# EAGLE board chess (EAGLE 6.1), part 1 of 2
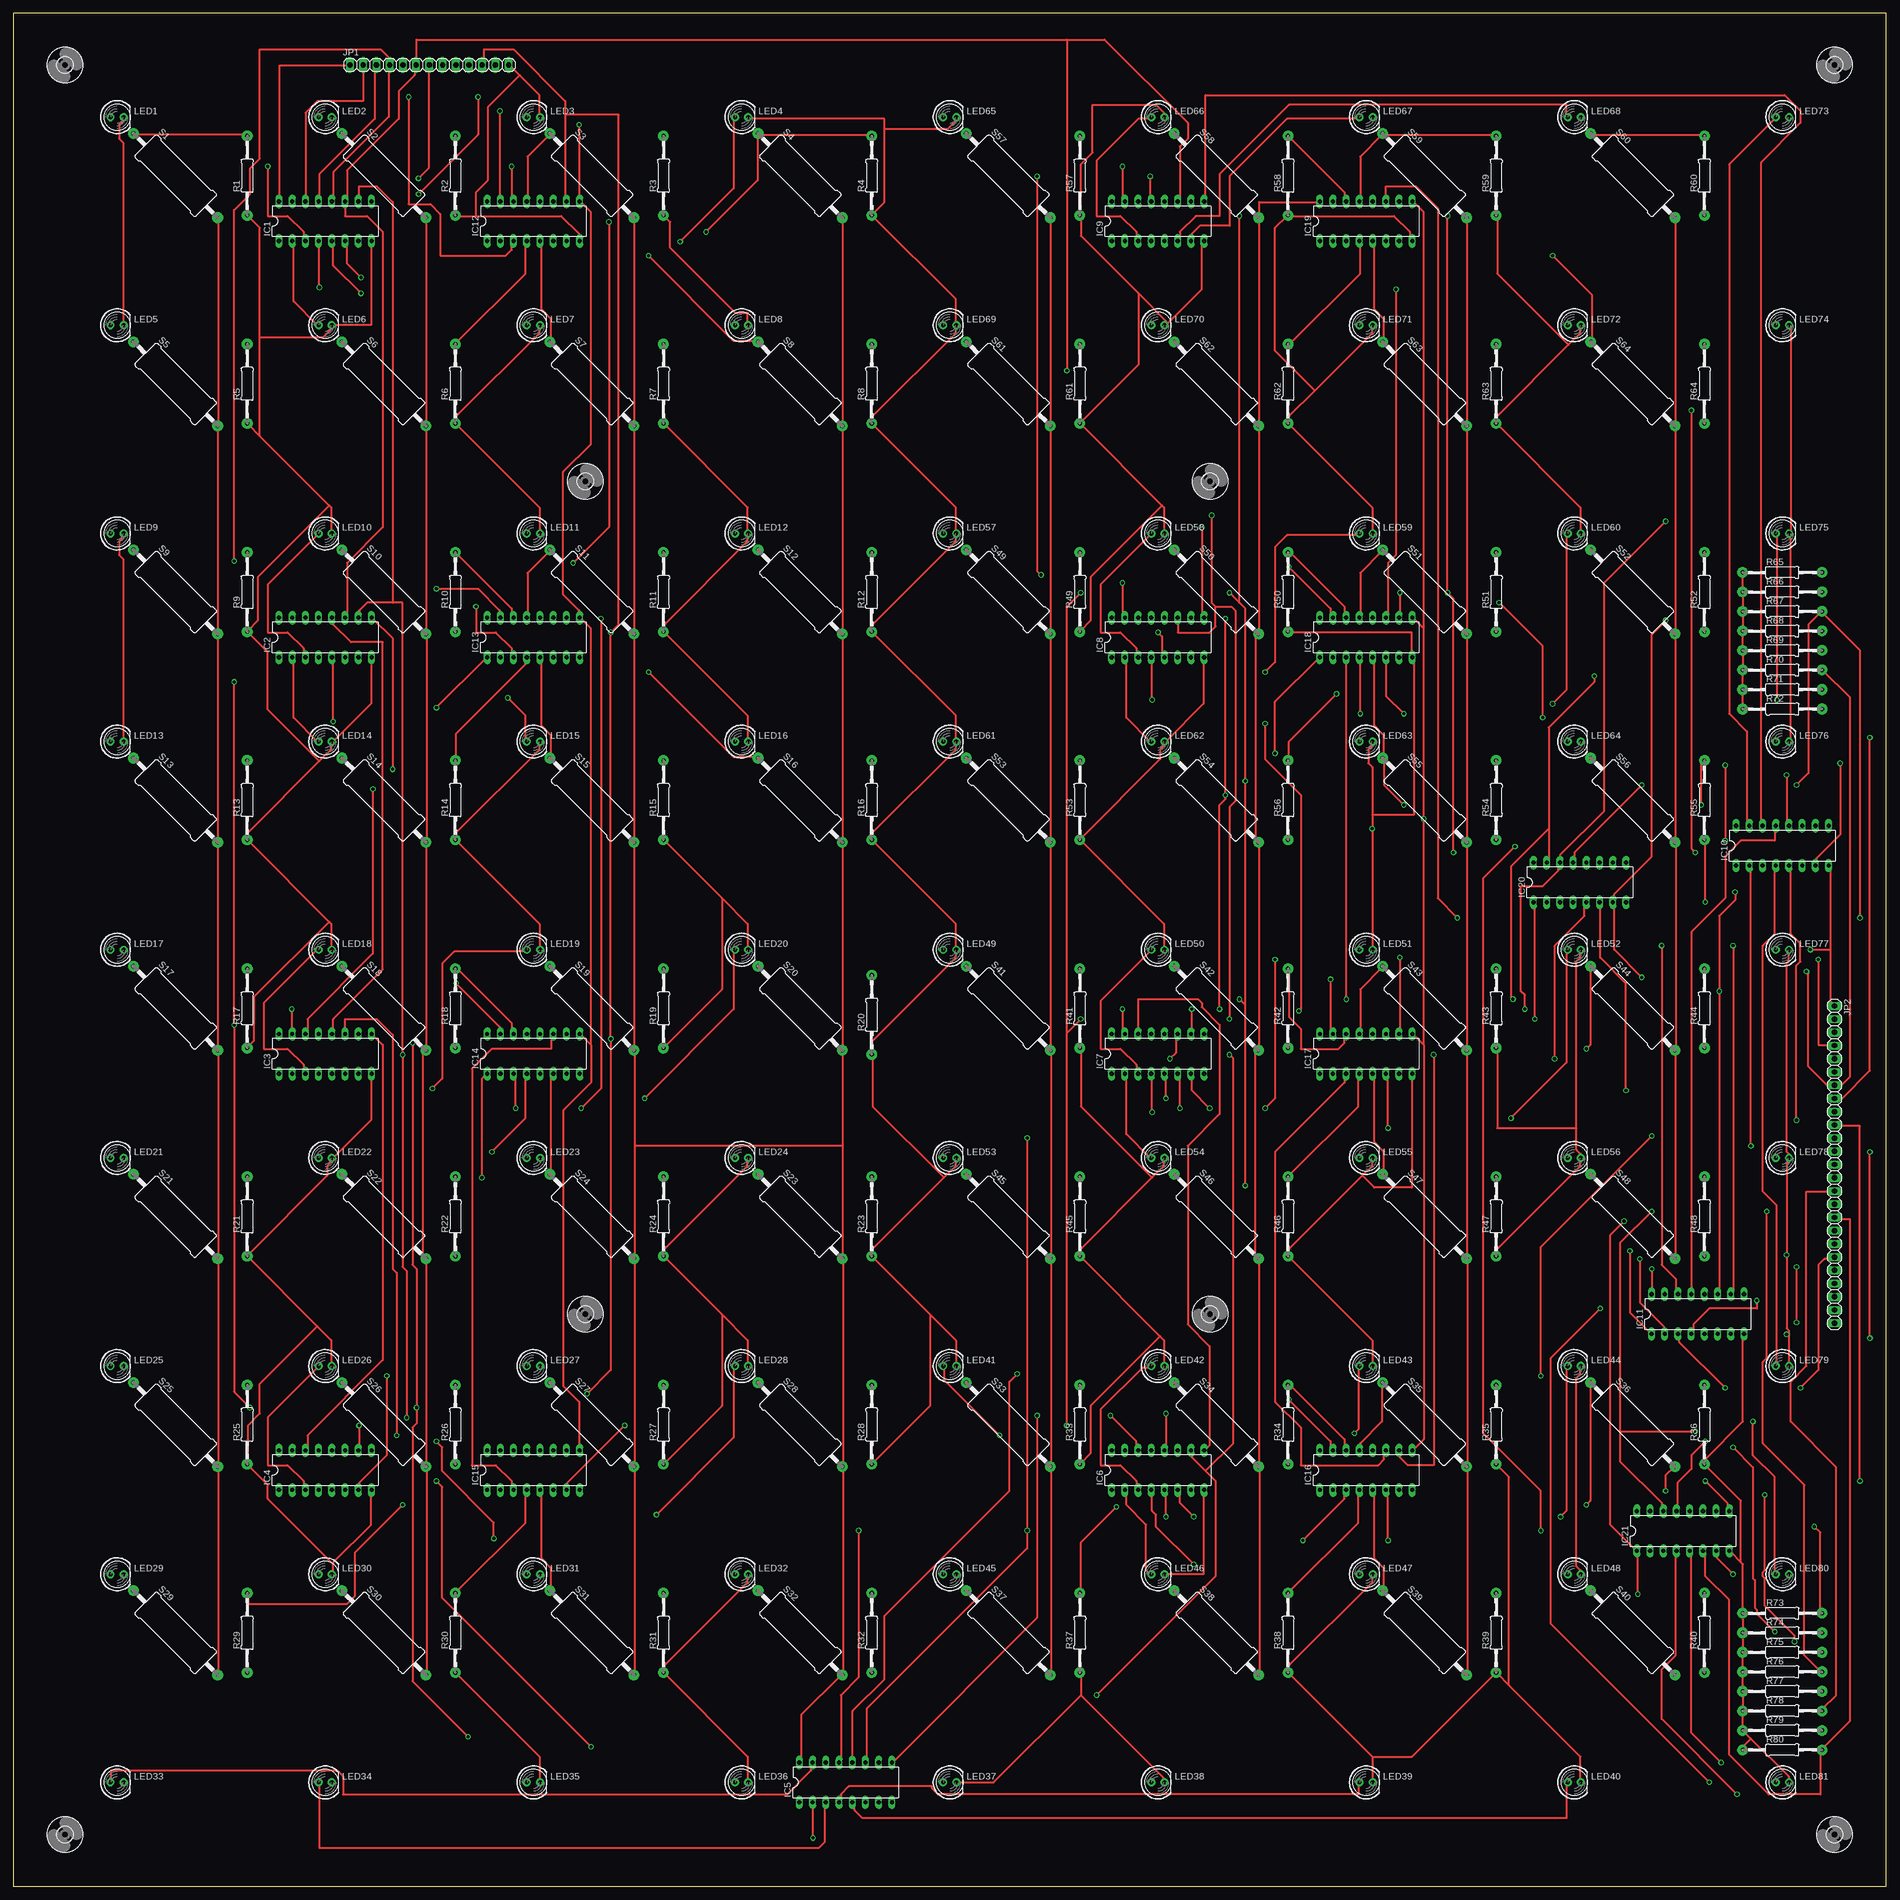
[diagram p5: board, top side]
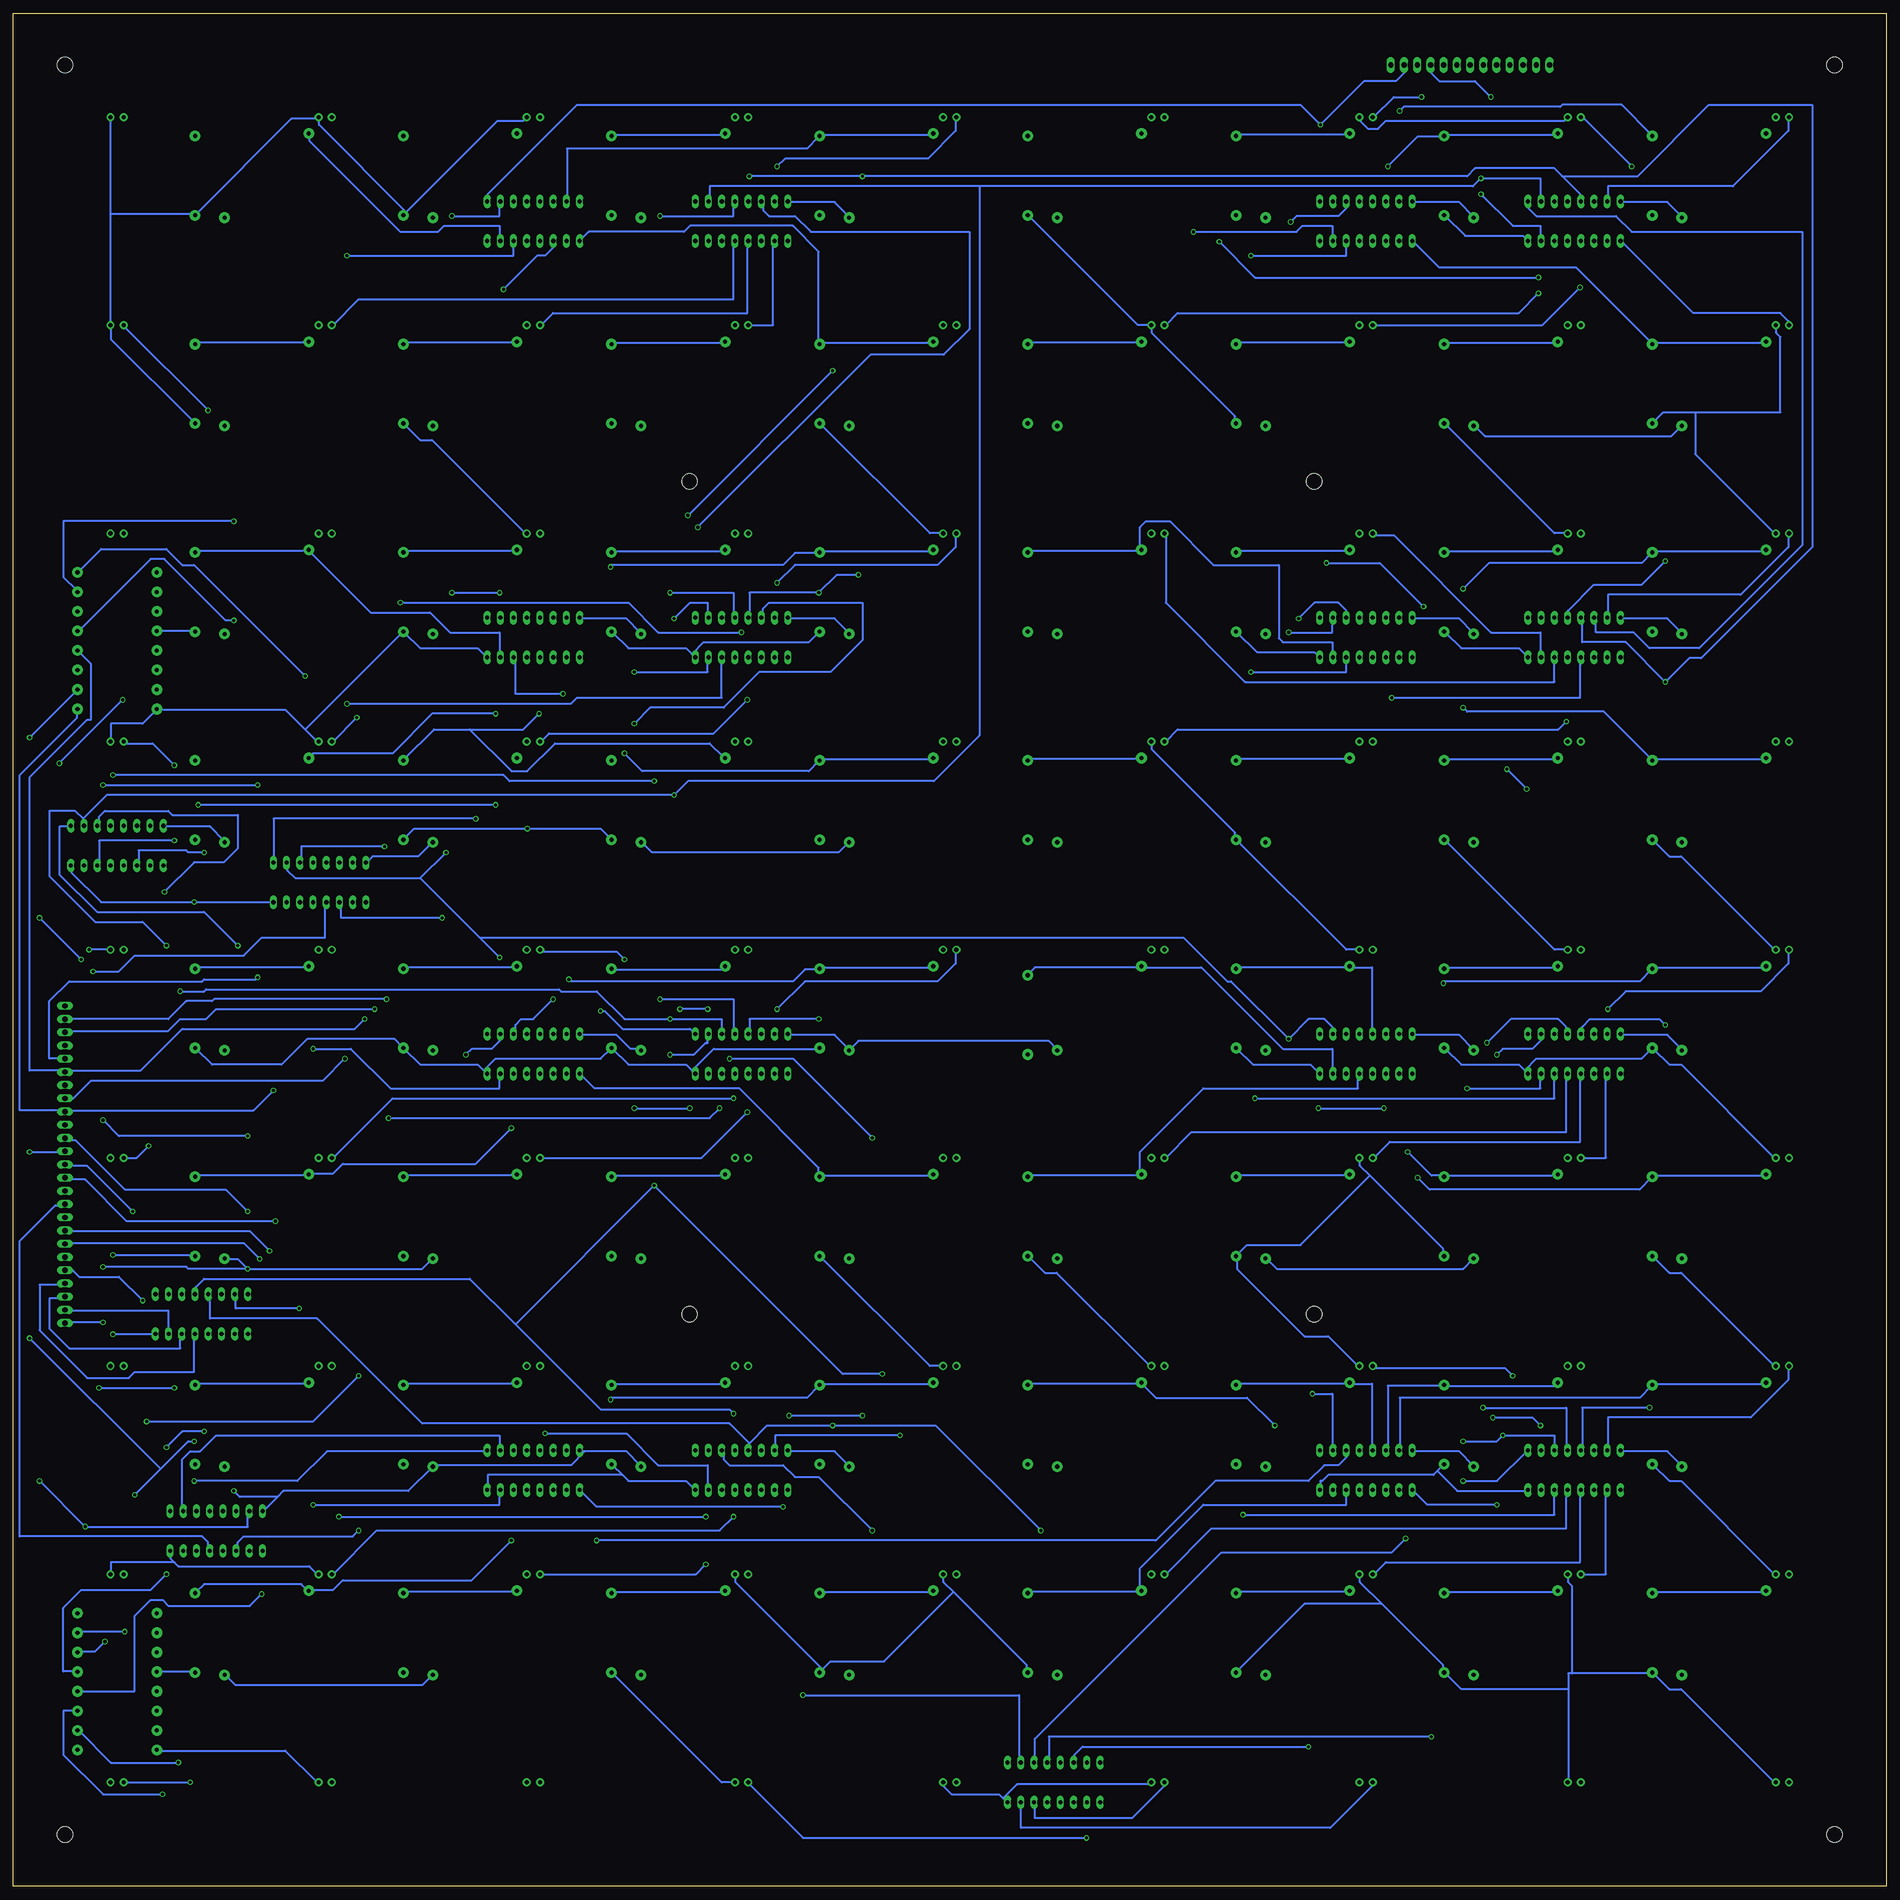
[diagram p6: board, bottom side, seen from below]

Size 360 x 360 mm. Coordinates in mm from the lower left corner, seen from the top.
Outline: 0,0 360,0 360,360 0,360 0,0
Copper layers (1*16): Top 0.035mm / dielectric 1.5mm / Bottom 0.035mm
Design rules: minimum track width 10mil, minimum drill 24mil, track to track 8mil, track to pad 8mil, pad to pad 8mil, via to via 8mil, smd to smd 8mil, copper to edge 40mil, drill to drill 8mil, minimum pad ring 10mil, minimum via ring 8mil, stop-mask expansion 4mil, vias tented up to drill 0mil, thermal gap 10mil
Net classes: 0 default: width 0.356 mm, clearance 1.219 mm

## Footprints (pad centres in the part's own frame; a part is rotated, then mirrored left to right if it is on the bottom)
3,0 = hole 3: 0,0
DIL16 = drill 0.813 long: 1 -8.89,-3.81; 2 -6.35,-3.81; 3 -3.81,-3.81; 4 -1.27,-3.81; 5 1.27,-3.81; 6 3.81,-3.81; 7 6.35,-3.81; 8 8.89,-3.81; 9 8.89,3.81; 10 6.35,3.81; 11 3.81,3.81; 12 1.27,3.81; 13 -1.27,3.81; 14 -3.81,3.81; 15 -6.35,3.81; 16 -8.89,3.81
1X13 = drill 1.016 long: 1 -15.24,0; 2 -12.7,0; 3 -10.16,0; 4 -7.62,0; 5 -5.08,0; 6 -2.54,0; 7 0,0; 8 2.54,0; 9 5.08,0; 10 7.62,0; 11 10.16,0; 12 12.7,0; 13 15.24,0
1X25 = drill 1.016 long: 1 -29.21,0; 2 -26.67,0; 3 -24.13,0; 4 -21.59,0; 5 -19.05,0; 6 -16.51,0; 7 -13.97,0; 8 -11.43,0; 9 -8.89,0; 10 -6.35,0; 11 -3.81,0; 12 -1.27,0; 13 1.27,0; 14 3.81,0; 15 6.35,0; 16 8.89,0; 17 11.43,0; 18 13.97,0; 19 16.51,0; 20 19.05,0; 21 21.59,0; 22 24.13,0; 23 26.67,0; 24 29.21,0; 25 31.75,0
LED5MM = drill 0.813 pad 1.524: A -1.27,0; K 1.27,0
0207/15 = drill 0.813 pad 2.032: 1 -7.62,0; 2 7.62,0
0617/22 = drill 0.813 pad 2.032: 1 -11.43,0; 2 11.43,0

## Placement (x,y rotation side)
H1  MOUNT-HOLE3.0  [3,0]  10,10 0 top
H2  MOUNT-HOLE3.0  [3,0]  10,350 0 top
H3  MOUNT-HOLE3.0  [3,0]  350,350 0 top
H4  MOUNT-HOLE3.0  [3,0]  350,10 0 top
H5  MOUNT-HOLE3.0  [3,0]  110,110 0 top
H6  MOUNT-HOLE3.0  [3,0]  230,110 0 top
H7  MOUNT-HOLE3.0  [3,0]  110,270 0 top
H8  MOUNT-HOLE3.0  [3,0]  230,270 0 top
IC1  74HC595N  [DIL16]  60,320 0 top
IC2  74HC595N  [DIL16]  60,240 0 top
IC3  74HC595N  [DIL16]  60,160 0 top
IC4  74HC595N  [DIL16]  60,80 0 top
IC5  74HC595N  [DIL16]  160,20 0 top
IC6  74HC595N  [DIL16]  220,80 0 top
IC7  74HC595N  [DIL16]  220,160 0 top
IC8  74HC595N  [DIL16]  220,240 0 top
IC9  74HC595N  [DIL16]  220,320 0 top
IC10  74HC595N  [DIL16]  340,200 0 top
IC11  74HC595N  [DIL16]  323.75,110 0 top
IC12  4021N  [DIL16]  100,320 0 top
IC13  4021N  [DIL16]  100,240 0 top
IC14  4021N  [DIL16]  100,160 0 top
IC15  4021N  [DIL16]  100,80 0 top
IC16  4021N  [DIL16]  260,80 0 top
IC17  4021N  [DIL16]  260,160 0 top
IC18  4021N  [DIL16]  260,240 0 top
IC19  4021N  [DIL16]  260,320 0 top
IC20  4021N  [DIL16]  301.07,192.93 0 top
IC21  4021N  [DIL16]  320.93,68.3 0 top
JP1  JP1  [1X13]  80,350 0 top
JP2  JP1  [1X25]  350,140 270 top
LED1  [LED5MM]  20,340 0 top
LED2  [LED5MM]  60,340 0 top
LED3  [LED5MM]  100,340 0 top
LED4  [LED5MM]  140,340 0 top
LED5  [LED5MM]  20,300 0 top
LED6  [LED5MM]  60,300 0 top
LED7  [LED5MM]  100,300 0 top
LED8  [LED5MM]  140,300 0 top
LED9  [LED5MM]  20,260 0 top
LED10  [LED5MM]  60,260 0 top
LED11  [LED5MM]  100,260 0 top
LED12  [LED5MM]  140,260 0 top
LED13  [LED5MM]  20,220 0 top
LED14  [LED5MM]  60,220 0 top
LED15  [LED5MM]  100,220 0 top
LED16  [LED5MM]  140,220 0 top
LED17  [LED5MM]  20,180 0 top
LED18  [LED5MM]  60,180 0 top
LED19  [LED5MM]  100,180 0 top
LED20  [LED5MM]  140,180 0 top
LED21  [LED5MM]  20,140 0 top
LED22  [LED5MM]  60,140 0 top
LED23  [LED5MM]  100,140 0 top
LED24  [LED5MM]  140,140 0 top
LED25  [LED5MM]  20,100 0 top
LED26  [LED5MM]  60,100 0 top
LED27  [LED5MM]  100,100 0 top
LED28  [LED5MM]  140,100 0 top
LED29  [LED5MM]  20,60 0 top
LED30  [LED5MM]  60,60 0 top
LED31  [LED5MM]  100,60 0 top
LED32  [LED5MM]  140,60 0 top
LED33  [LED5MM]  20,20 0 top
LED34  [LED5MM]  60,20 0 top
LED35  [LED5MM]  100,20 0 top
LED36  [LED5MM]  140,20 0 top
LED37  [LED5MM]  180,20 0 top
LED38  [LED5MM]  220,20 0 top
LED39  [LED5MM]  260,20 0 top
LED40  [LED5MM]  300,20 0 top
LED41  [LED5MM]  180,100 0 top
LED42  [LED5MM]  220,100 0 top
LED43  [LED5MM]  260,100 0 top
LED44  [LED5MM]  300,100 0 top
LED45  [LED5MM]  180,60 0 top
LED46  [LED5MM]  220,60 0 top
LED47  [LED5MM]  260,60 0 top
LED48  [LED5MM]  300,60 0 top
LED49  [LED5MM]  180,180 0 top
LED50  [LED5MM]  220,180 0 top
LED51  [LED5MM]  260,180 0 top
LED52  [LED5MM]  300,180 0 top
LED53  [LED5MM]  180,140 0 top
LED54  [LED5MM]  220,140 0 top
LED55  [LED5MM]  260,140 0 top
LED56  [LED5MM]  300,140 0 top
LED57  [LED5MM]  180,260 0 top
LED58  [LED5MM]  220,260 0 top
LED59  [LED5MM]  260,260 0 top
LED60  [LED5MM]  300,260 0 top
LED61  [LED5MM]  180,220 0 top
LED62  [LED5MM]  220,220 0 top
LED63  [LED5MM]  260,220 0 top
LED64  [LED5MM]  300,220 0 top
LED65  [LED5MM]  180,340 0 top
LED66  [LED5MM]  220,340 0 top
LED67  [LED5MM]  260,340 0 top
LED68  [LED5MM]  300,340 0 top
LED69  [LED5MM]  180,300 0 top
LED70  [LED5MM]  220,300 0 top
LED71  [LED5MM]  260,300 0 top
LED72  [LED5MM]  300,300 0 top
LED73  [LED5MM]  340,340 0 top
LED74  [LED5MM]  340,300 0 top
LED75  [LED5MM]  340,260 0 top
LED76  [LED5MM]  340,220 0 top
LED77  [LED5MM]  340,180 0 top
LED78  [LED5MM]  340,140 0 top
LED79  [LED5MM]  340,100 0 top
LED80  [LED5MM]  340,60 0 top
LED81  [LED5MM]  340,20 0 top
R1  [0207/15]  45,328.75 90 top
R2  [0207/15]  85,328.75 90 top
R3  [0207/15]  125,328.75 90 top
R4  [0207/15]  165,328.75 90 top
R5  [0207/15]  45,288.75 90 top
R6  [0207/15]  85,288.75 90 top
R7  [0207/15]  125,288.75 90 top
R8  [0207/15]  165,288.75 90 top
R9  [0207/15]  45,248.75 90 top
R10  [0207/15]  85,248.75 90 top
R11  [0207/15]  125,248.75 90 top
R12  [0207/15]  165,248.75 90 top
R13  [0207/15]  45,208.75 90 top
R14  [0207/15]  85,208.75 90 top
R15  [0207/15]  125,208.75 90 top
R16  [0207/15]  165,208.75 90 top
R17  [0207/15]  45,168.75 90 top
R18  [0207/15]  85,168.75 90 top
R19  [0207/15]  125,168.75 90 top
R20  [0207/15]  165,167.5 90 top
R21  [0207/15]  45,128.75 90 top
R22  [0207/15]  85,128.75 90 top
R23  [0207/15]  165,128.75 90 top
R24  [0207/15]  125,128.75 90 top
R25  [0207/15]  45,88.75 90 top
R26  [0207/15]  85,88.75 90 top
R27  [0207/15]  125,88.75 90 top
R28  [0207/15]  165,88.75 90 top
R29  [0207/15]  45,48.75 90 top
R30  [0207/15]  85,48.75 90 top
R31  [0207/15]  125,48.75 90 top
R32  [0207/15]  165,48.75 90 top
R33  [0207/15]  205,88.75 90 top
R34  [0207/15]  245,88.75 90 top
R35  [0207/15]  285,88.75 90 top
R36  [0207/15]  325,88.75 90 top
R37  [0207/15]  205,48.75 90 top
R38  [0207/15]  245,48.75 90 top
R39  [0207/15]  285,48.75 90 top
R40  [0207/15]  325,48.75 90 top
R41  [0207/15]  205,168.75 90 top
R42  [0207/15]  245,168.75 90 top
R43  [0207/15]  285,168.75 90 top
R44  [0207/15]  325,168.75 90 top
R45  [0207/15]  205,128.75 90 top
R46  [0207/15]  245,128.75 90 top
R47  [0207/15]  285,128.75 90 top
R48  [0207/15]  325,128.75 90 top
R49  [0207/15]  205,248.75 90 top
R50  [0207/15]  245,248.75 90 top
R51  [0207/15]  285,248.75 90 top
R52  [0207/15]  325,248.75 90 top
R53  [0207/15]  205,208.75 90 top
R54  [0207/15]  285,208.75 90 top
R55  [0207/15]  325,208.75 90 top
R56  [0207/15]  245,208.75 90 top
R57  [0207/15]  205,328.75 90 top
R58  [0207/15]  245,328.75 90 top
R59  [0207/15]  285,328.75 90 top
R60  [0207/15]  325,328.75 90 top
R61  [0207/15]  205,288.75 90 top
R62  [0207/15]  245,288.75 90 top
R63  [0207/15]  285,288.75 90 top
R64  [0207/15]  325,288.75 90 top
R65  [0207/15]  340,252.5 0 top
R66  [0207/15]  340,248.75 0 top
R67  [0207/15]  340,245 0 top
R68  [0207/15]  340,241.25 0 top
R69  [0207/15]  340,237.5 0 top
R70  [0207/15]  340,233.75 0 top
R71  [0207/15]  340,230 0 top
R72  [0207/15]  340,226.25 0 top
R73  [0207/15]  340,52.5 0 top
R74  [0207/15]  340,48.75 0 top
R75  [0207/15]  340,45 0 top
R76  [0207/15]  340,41.25 0 top
R77  [0207/15]  340,37.5 0 top
R78  [0207/15]  340,33.75 0 top
R79  [0207/15]  340,30 0 top
R80  [0207/15]  340,26.25 0 top
S1  [0617/22]  31.25,328.75 315 top
S2  [0617/22]  71.25,328.75 315 top
S3  [0617/22]  111.25,328.75 315 top
S4  [0617/22]  151.25,328.75 315 top
S5  [0617/22]  31.25,288.75 315 top
S6  [0617/22]  71.25,288.75 315 top
S7  [0617/22]  111.25,288.75 315 top
S8  [0617/22]  151.25,288.75 315 top
S9  [0617/22]  31.25,248.75 315 top
S10  [0617/22]  71.25,248.75 315 top
S11  [0617/22]  111.25,248.75 315 top
S12  [0617/22]  151.25,248.75 315 top
S13  [0617/22]  31.25,208.75 315 top
S14  [0617/22]  71.25,208.75 315 top
S15  [0617/22]  111.25,208.75 315 top
S16  [0617/22]  151.25,208.75 315 top
S17  [0617/22]  31.25,168.75 315 top
S18  [0617/22]  71.25,168.75 315 top
S19  [0617/22]  111.25,168.75 315 top
S20  [0617/22]  151.25,168.75 315 top
S21  [0617/22]  31.25,128.75 315 top
S22  [0617/22]  71.25,128.75 315 top
S23  [0617/22]  151.25,128.75 315 top
S24  [0617/22]  111.25,128.75 315 top
S25  [0617/22]  31.25,88.75 315 top
S26  [0617/22]  71.25,88.75 315 top
S27  [0617/22]  111.25,88.75 315 top
S28  [0617/22]  151.25,88.75 315 top
S29  [0617/22]  31.25,48.75 315 top
S30  [0617/22]  71.25,48.75 315 top
S31  [0617/22]  111.25,48.75 315 top
S32  [0617/22]  151.25,48.75 315 top
S33  [0617/22]  191.25,88.75 315 top
S34  [0617/22]  231.25,88.75 315 top
S35  [0617/22]  271.25,88.75 315 top
S36  [0617/22]  311.25,88.75 315 top
S37  [0617/22]  191.25,48.75 315 top
S38  [0617/22]  231.25,48.75 315 top
S39  [0617/22]  271.25,48.75 315 top
S40  [0617/22]  311.25,48.75 315 top
S41  [0617/22]  191.25,168.75 315 top
S42  [0617/22]  231.25,168.75 315 top
S43  [0617/22]  271.25,168.75 315 top
S44  [0617/22]  311.25,168.75 315 top
S45  [0617/22]  191.25,128.75 315 top
S46  [0617/22]  231.25,128.75 315 top
S47  [0617/22]  271.25,128.75 315 top
S48  [0617/22]  311.25,128.75 315 top
S49  [0617/22]  191.25,248.75 315 top
S50  [0617/22]  231.25,248.75 315 top
S51  [0617/22]  271.25,248.75 315 top
S52  [0617/22]  311.25,248.75 315 top
S53  [0617/22]  191.25,208.75 315 top
S54  [0617/22]  231.25,208.75 315 top
S55  [0617/22]  271.25,208.75 315 top
S56  [0617/22]  311.25,208.75 315 top
S57  [0617/22]  191.25,328.75 315 top
S58  [0617/22]  231.25,328.75 315 top
S59  [0617/22]  271.25,328.75 315 top
S60  [0617/22]  311.25,328.75 315 top
S61  [0617/22]  191.25,288.75 315 top
S62  [0617/22]  231.25,288.75 315 top
S63  [0617/22]  271.25,288.75 315 top
S64  [0617/22]  311.25,288.75 315 top

## Tracks (layer width: path | path; a pad name or v marks a point on that pad's centre or on a via)
CLK  (via drill 0.61)
  Top 0.356: 106.11,340.43 106.11,343.09 96.2,353 90.49,353 90.49,350.33 JP1.11 | 106.11,340.43 106.11,324.04 IC12.10 | v110.3,94.68 114.87,99.25 v114.87,162.88 v114.87,240.99 116.4,242.51 116.4,340.43 106.11,340.43 | v266.51,178.5 266.51,164.02 IC17.10 | v266.51,248.61 266.51,244.03 IC18.10 | v276.8,198.69 276.8,247.46 v275.66,248.61 v275.66,321 | v272.99,159.83 272.99,80.97 268.04,80.97 266.51,82.49 266.51,83.63 IC16.10
  Bottom 0.356: v110.3,94.68 106.49,94.68 106.49,84.01 IC15.10 | IC14.10 106.49,164.02 106.49,165.17 108.02,166.69 111.06,166.69 v114.87,162.88 125.92,173.93 126.69,173.93 135.07,182.31 270.32,182.31 | v114.87,240.99 106.49,240.99 106.49,243.65 IC13.10 | IC16.10 266.51,84.01 266.51,86.68 321,86.68 324.04,83.63 325.95,83.63 327.47,82.11 327.47,72.2 IC21.10 | 281.75,193.74 270.32,182.31 | 270.32,182.31 v266.51,178.5 | 281.75,193.74 305.75,193.74 307.28,195.26 307.28,196.41 IC20.10 | v275.66,248.61 v266.51,248.61 | 281.75,193.74 v276.8,198.69 | v275.66,321 266.51,321 266.51,323.66 IC19.10 | v272.99,159.83 271.85,160.97 268.04,160.97 266.51,162.5 266.51,163.64 IC17.10
G  (via drill 0.61)
  Top 0.356: IC11.13 322.52,114.11 322.52,183.45 329,189.93 329,197.93 332.04,200.98 338.52,200.98 338.52,203.65 IC10.13 | v162.5,68.39 162.5,40.2 159.07,36.77 159.07,23.81 IC5.13 | 202.5,164.02 v205.17,166.69 | v202.5,88.58 202.5,164.02 | v205.17,248.61 202.5,245.94 202.5,164.02 | v45.53,92.01 42.48,95.06 v42.48,165.55 v42.48,231.46 | IC1.13 58.87,324.04 58.87,329 69.53,339.66 69.53,349.95 JP1.3 | v218.51,328.62 218.51,324.04 IC9.13 | v197.55,252.03 196.79,252.8 v196.79,328.62
  Bottom 0.356: v162.5,68.39 182.69,88.58 v202.5,88.58 215.08,88.58 218.51,85.16 | 218.51,85.16 218.51,84.01 IC6.13 | v205.17,166.69 218.51,166.69 218.51,164.02 IC7.13 | IC8.13 218.51,244.03 218.51,248.61 v205.17,248.61 201.74,252.03 v197.55,252.03 | 218.51,85.16 222.32,88.97 281.37,88.97 301.56,109.16 322.14,109.16 322.14,113.73 IC11.13 | v45.53,92.01 58.49,92.01 58.49,84.01 IC4.13 | v42.48,165.55 43.63,166.69 56.96,166.69 58.49,165.17 58.49,164.02 IC3.13 | IC2.13 58.49,243.65 58.49,239.08 50.1,239.08 v42.48,231.46 37.91,236.03 35.63,236.03 14.29,257.37 14.29,342.33 34.1,342.33 47.82,328.62 62.3,328.62 | v218.51,328.62 v196.79,328.62 80.58,328.62 79.06,330.14 63.82,330.14 62.3,328.62 | 62.3,328.62 58.87,325.19 58.87,324.04 IC1.13
GND  (via drill 0.61)
  Top 0.356: LED74.K 341.57,299.66 341.57,260.04 LED75.K 341.57,259.65 341.57,220.03 LED76.K | IC19.8 268.8,316.42 268.42,316.8 268.42,317.95 265.37,321 245.18,321 R58.1 244.8,321 242.51,318.71 242.51,295.09 250.13,287.47 | LED59.K 261.18,260.04 261.18,264.99 245.18,280.99 R62.1 245.18,281.37 245.18,282.51 250.13,287.47 | 250.13,287.47 261.18,298.52 261.18,299.66 LED71.K | LED60.K 301.18,260.04 301.18,264.99 285.18,280.99 R63.1 285.18,281.37 285.18,282.51 298.9,296.23 | 298.9,296.23 301.18,298.52 301.18,299.66 LED72.K | 298.9,296.23 285.18,309.95 285.18,321 R59.1 | LED50.K 221.17,180.03 221.17,184.98 205.17,200.98 R53.1 205.17,201.36 220.41,216.6 220.41,218.51 221.17,219.27 221.17,219.65 LED62.K 221.55,220.03 228.79,227.27 228.79,236.03 IC8.8 | 261.18,205.93 261.18,215.08 260.42,215.84 260.42,218.51 261.18,219.27 261.18,219.65 LED63.K | 261.18,205.93 v261.18,203.27 261.18,180.03 LED51.K | R65.1 332.43,252.42 332.43,248.99 R66.1 332.43,248.61 332.43,245.18 R67.1 332.43,244.8 332.43,241.37 R68.1 332.43,240.99 332.43,237.56 R69.1 332.43,237.18 332.43,234.13 R70.1 332.43,233.75 332.43,230.32 R71.1 332.43,229.94 332.43,226.51 R72.1 | 261.18,205.93 269.18,205.93 269.18,236.03 IC18.8 268.8,236.41 268.8,240.99 245.18,240.99 R50.1 | R47.1 285.18,121.35 285.18,122.49 301.18,138.5 301.18,139.64 LED56.K 301.18,140.02 301.18,140.78 300.42,141.54 300.42,145.74 | 300.42,145.74 300.42,177.74 301.18,178.5 301.18,179.64 LED52.K | 220.41,105.73 205.17,120.97 R45.1 205.17,121.35 205.17,122.49 218.89,136.21 | 220.41,105.73 221.17,104.97 221.17,100.02 LED42.K
  Top 0.356: 218.89,136.21 221.17,138.5 221.17,139.64 LED54.K | 220.41,105.73 207.08,92.39 207.08,83.25 205.17,81.35 R33.1 | LED43.K 261.18,100.02 261.18,104.97 245.18,120.97 R46.1 245.18,121.35 245.18,122.49 259.27,136.59 | 259.27,136.59 261.18,138.5 261.18,139.64 LED55.K | 259.27,136.59 261.56,134.31 268.8,134.31 268.8,156.02 IC17.8 | 218.89,136.21 205.17,149.93 205.17,160.97 R41.1 | 300.42,145.74 285.18,145.74 285.18,160.97 R43.1 | 136.21,109.92 125.16,120.97 R24.1 125.16,121.35 125.16,122.49 141.16,138.5 141.16,139.64 LED24.K | 136.21,109.92 141.16,104.97 141.16,100.02 LED28.K | 136.21,109.92 136.21,92.39 125.16,81.35 R27.1 | 220.79,265.37 205.17,280.99 R61.1 205.17,281.37 216.22,292.42 216.22,306.14 | 220.79,265.37 221.17,264.99 221.17,260.04 LED58.K | 221.94,300.42 221.55,300.04 LED70.K | 221.94,300.42 228.41,306.9 228.41,315.66 228.79,316.04 IC9.8 | LED66.K 221.17,340.05 221.17,340.81 219.65,342.33 207.46,342.33 207.46,333.19 205.17,330.9 205.17,321.38 R57.1 205.17,321 205.17,317.19 216.22,306.14 | 216.22,306.14 221.94,300.42 | 176.22,109.92 165.17,120.97 R23.1 165.17,121.35 165.17,122.49 178.88,136.21 | 176.22,109.92 181.17,104.97 181.17,100.02 LED41.K | 178.88,136.21 181.17,138.5 181.17,139.64 LED53.K | 176.22,109.92 176.22,92.39 165.17,81.35 R28.1 | 167.45,337.76 167.45,323.66 165.17,321.38 R4.1 165.17,321 181.17,304.99 181.17,300.04 LED69.K 181.17,299.66 181.17,298.52 165.17,282.51 165.17,281.37 R8.1 165.17,280.99 181.17,264.99 181.17,260.04 LED57.K 181.17,259.65 181.17,258.51 165.17,242.51 165.17,241.37 R12.1 165.17,240.99 181.17,224.98 181.17,220.03 LED61.K 181.17,219.65 181.17,218.51 165.17,202.5 165.17,201.36 R16.1 165.17,200.98 181.17,184.98 181.17,180.03 LED49.K 181.17,179.64 181.17,178.5 165.17,162.5 165.17,160.21 R20.1 165.17,159.83 165.17,149.93 178.88,136.21
  Top 0.356: 167.45,337.76 167.45,339.66 141.54,339.66 LED4.K | 167.45,337.76 179.64,337.76 181.17,339.28 181.17,339.66 LED65.K | 220.79,265.37 207.08,251.65 207.08,243.27 205.17,241.37 R49.1 | 97.35,348.05 101.16,344.24 101.16,340.05 LED3.K | 97.35,348.05 95.44,349.95 JP1.13 | 88.97,321 85.16,321 R2.1 | 88.97,321 105.35,321 108.78,317.57 108.78,316.42 IC12.8 | IC1.8 68.77,316.04 68.77,300.04 61.53,300.04 LED6.K 61.15,299.66 61.15,299.28 59.63,297.75 47.44,297.75 | 97.35,348.05 91.25,341.95 91.25,327.85 88.97,325.57 88.97,321 | LED11.K 101.16,260.04 101.16,264.99 85.16,280.99 R6.1 85.16,281.37 85.16,282.51 101.16,298.52 101.16,299.66 LED7.K | LED5.K 21.15,300.04 21.15,335.09 20.39,335.85 20.39,338.52 21.15,339.28 21.15,339.66 LED1.K | LED13.K 21.15,220.03 21.15,255.08 20.39,255.84 20.39,258.51 21.15,259.27 21.15,259.65 LED9.K | 47.44,278.7 45.15,280.99 R5.1 | 47.44,278.7 60.77,265.37 | 60.77,265.37 61.15,264.99 61.15,260.04 LED10.K | 60.77,265.37 47.06,251.65 47.06,243.27 45.15,241.37 R9.1 45.15,240.99 48.96,237.18 48.96,226.13 58.87,216.22 | 47.44,278.7 47.44,297.75 | 47.44,297.75 47.44,318.71 45.15,321 R1.1 | R3.1 125.16,321 126.3,319.85 126.3,314.9 138.88,302.33 141.16,302.33 141.16,300.04 LED8.K | LED16.K 141.16,220.03 141.16,224.98 125.16,240.99 R11.1 125.16,241.37 125.16,242.51 141.16,258.51 141.16,259.65 LED12.K 141.16,260.04 141.16,264.99 125.16,280.99 R7.1 | 58.49,107.64 45.15,120.97 R21.1 45.15,121.35 60.39,136.59 60.39,138.5 61.15,139.26 61.15,139.64 LED22.K 61.53,140.02 68.77,147.26 68.77,156.02 IC3.8 | 58.49,107.64 61.15,104.97 61.15,100.02 LED26.K
  Top 0.356: 136.21,189.93 125.16,200.98 R15.1 | 136.21,189.93 141.16,184.98 141.16,180.03 LED20.K | 136.21,189.93 136.21,172.41 125.16,161.36 R19.1 | LED19.K 101.16,180.03 101.16,184.98 85.16,200.98 R14.1 85.16,201.36 85.16,202.5 101.16,218.51 101.16,219.65 LED15.K | IC2.8 68.77,236.03 68.77,227.27 61.53,220.03 LED14.K 61.15,219.65 61.15,218.51 58.87,216.22 | 60.77,185.36 45.15,200.98 R13.1 45.15,201.36 45.15,202.5 58.87,216.22 | 60.77,185.36 61.15,184.98 61.15,180.03 LED18.K | 60.77,185.36 46.29,170.88 46.29,162.5 45.15,161.36 R17.1 | 349.19,180.03 349.19,196.03 IC10.8 | 349.19,180.03 349.19,170.12 349.95,169.36 JP2.1 | v325.19,189.17 325.19,200.98 R55.1 | 341.19,106.11 341.19,106.87 340.81,107.25 v340.81,121.35 340.81,138.88 341.19,139.26 341.19,139.64 LED78.K 341.19,140.02 341.19,140.78 340.81,141.16 340.81,177.36 341.19,177.74 341.19,179.64 LED77.K | 341.19,106.11 341.19,100.02 LED79.K | v345.38,180.03 349.19,180.03 | IC11.8 332.43,106.11 332.43,89.35 325.19,82.11 325.19,81.35 R36.1 325.19,80.97 332.04,74.11 332.04,62.3 | 332.04,62.3 332.43,61.92 332.43,52.77 R73.1 332.43,52.39 332.43,48.96 R74.1 332.43,48.58 332.43,45.15 R75.1 332.43,44.77 332.43,41.34 R76.1 332.43,40.96 332.43,37.53 R77.1 332.43,37.15 332.43,34.1 R78.1 332.43,33.72 332.43,30.29 R79.1 332.43,29.91 333.95,28.39 | 332.04,62.3 330.14,64.2 IC21.8 | LED44.K 301.18,99.63 301.18,98.49 300.42,97.73 300.42,61.53 301.18,60.77 301.18,60.01 LED48.K | 333.95,28.39 341.19,21.15 341.19,20.01 LED81.K | 287.47,38.67 301.18,24.96 301.18,20.01 LED40.K | 287.47,38.67 285.18,40.96 R39.1 284.8,40.96 268.8,24.96 261.18,24.96
  Top 0.356: 287.47,38.67 287.47,78.68 285.18,80.97 R35.1 | 333.95,28.39 332.43,26.86 332.43,26.48 R80.1 | v340.81,106.11 341.19,106.11 | LED46.K 221.55,60.01 228.79,60.01 228.79,76.01 IC6.8 | 261.18,24.96 261.18,20.01 LED39.K | 261.18,24.96 245.18,40.96 R38.1 245.18,41.34 245.18,42.48 261.18,58.49 261.18,59.63 LED47.K | 205.17,36.77 221.17,20.77 221.17,20.01 LED38.K | 205.17,36.77 205.17,40.96 R37.1 | 61.53,61.92 61.53,60.01 LED30.K | 61.53,61.92 61.53,62.3 68.77,69.53 68.77,76.01 IC4.8 | 61.53,61.92 48.96,74.49 48.96,77.16 45.15,80.97 R25.1 45.15,81.35 45.15,88.58 47.44,90.87 47.44,96.59 58.49,107.64 | LED36.K 141.16,20.01 141.16,24.96 125.16,40.96 R31.1 125.16,41.34 125.16,42.48 141.16,58.49 141.16,59.63 LED32.K | LED35.K 101.16,20.01 101.16,24.96 85.16,40.96 R30.1 | 205.17,36.77 188.41,20.01 181.55,20.01 LED37.K
  Bottom 0.356: 341.19,321.38 341.19,339.66 LED73.K | 341.19,321.38 325.19,321.38 R60.1 324.81,321.38 306.52,339.66 301.56,339.66 LED68.K 301.18,339.66 301.18,338.52 284.42,321.76 | R64.1 325.19,281.37 341.19,297.37 341.19,299.66 LED74.K 341.19,300.04 341.19,321.38 | 284.42,321.76 284.8,321.38 R59.1 284.42,321.76 | 284.42,321.76 266.89,339.28 261.94,339.28 261.56,339.66 LED67.K | LED59.K 261.56,260.04 279.47,277.94 281.75,277.94 284.8,280.99 R63.1 | 229.56,236.79 230.7,237.94 241.75,237.94 244.8,240.99 R50.1 | 229.56,236.79 229.17,236.41 IC8.8 | 229.56,236.79 227.27,239.08 207.08,239.08 205.17,240.99 R49.1 | R56.1 245.18,201.36 247.08,203.27 v261.18,203.27 282.89,203.27 284.8,201.36 R54.1 | IC18.8 269.18,236.41 270.7,237.94 281.75,237.94 284.8,240.99 R51.1 285.18,240.99 303.85,222.32 | R52.1 325.19,241.37 332.04,241.37 R68.1 | 303.85,222.32 307.66,226.13 332.04,226.13 R72.1 332.43,226.13 335.09,223.46 341.19,223.46 341.19,220.03 LED76.K | 303.85,222.32 301.56,220.03 LED64.K | 229.56,156.78 230.7,157.93 241.75,157.93 244.8,160.97 R42.1 245.18,160.97 247.08,159.07 267.27,159.07 269.56,156.78 | 229.56,156.78 229.17,156.4 IC7.8 | 229.56,156.78 225.36,160.97 205.17,160.97 R41.1 | 269.56,156.78 270.7,157.93 281.75,157.93 284.8,160.97 R43.1 285.18,161.36 286.7,162.88 303.47,162.88 308.42,157.93 321.76,157.93 324.81,160.97 R44.1 | 269.56,156.78 269.18,156.4 IC17.8 | 99.25,136.59 85.16,122.49 85.16,121.35 R22.1 | 99.25,136.59 101.16,138.5 101.16,139.64 LED23.K | LED27.K 101.54,100.02 107.25,105.73 111.83,105.73 124.78,118.68 124.78,120.97 R24.1 124.78,121.35 122.88,123.26 112.59,123.26 99.25,136.59
  Bottom 0.356: R61.1 204.79,280.99 183.84,260.04 181.55,260.04 LED57.K | LED28.K 141.54,100.02 159.45,117.92 161.74,117.92 164.78,120.97 R23.1 | R45.1 204.79,120.97 183.84,100.02 181.55,100.02 LED41.K | LED2.K 61.53,339.66 61.92,339.28 96.2,339.28 97.73,337.76 99.63,337.76 101.54,339.66 LED3.K | IC1.8 69.15,316.42 69.92,317.19 80.97,317.19 84.78,321 R2.1 | 36.77,283.28 36.77,275.27 21.53,260.04 LED9.K | 36.77,283.28 42.87,283.28 44.77,281.37 R5.1 | 36.77,283.28 20.39,283.28 20.39,297.75 21.15,298.52 21.15,299.66 LED5.K | R6.1 84.78,280.99 63.82,260.04 61.53,260.04 LED10.K | R7.1 125.16,281.37 125.16,282.51 141.16,298.52 141.16,299.66 LED8.K 141.54,300.04 143.83,300.04 164.78,321 R4.1 | IC13.8 109.16,236.41 109.92,237.18 120.97,237.18 124.78,240.99 R11.1 | LED25.K 21.53,100.02 39.44,117.92 41.72,117.92 44.77,120.97 R21.1 | LED21.K 21.53,140.02 39.44,157.93 41.72,157.93 44.77,160.97 R17.1 45.15,160.97 47.06,159.07 67.25,159.07 69.53,156.78 | 69.53,156.78 70.68,157.93 81.73,157.93 84.78,160.97 R18.1 | 69.53,156.78 69.15,156.4 IC3.8 69.53,156.78 | IC14.8 109.16,156.4 110.68,157.93 121.73,157.93 124.78,160.97 R19.1 | IC2.8 69.15,236.41 70.68,237.94 81.73,237.94 84.78,240.99 R10.1 | LED17.K 21.53,180.03 39.44,197.93 41.72,197.93 44.77,200.98 R13.1 | R14.1 84.78,200.98 63.82,180.03 61.53,180.03 LED18.K | LED19.K 101.54,180.03 103.83,180.03 124.78,200.98 R15.1 125.16,201.36 125.16,202.5 141.16,218.51 141.16,219.65 LED16.K | IC20.8 310.33,189.17 v325.19,189.17 343.09,189.17 348.81,194.88 348.81,196.03 IC10.8 | v340.81,121.35 325.19,121.35 R48.1 | v345.38,180.03 341.57,180.03 LED77.K
  Bottom 0.356: R40.1 325.19,41.34 332.04,41.34 R76.1 | 329,62.3 329.76,63.06 329.76,64.2 IC21.8 | 329,62.3 328.23,61.53 303.09,61.53 301.56,60.01 LED48.K | 329,62.3 341.19,62.3 341.19,60.01 LED80.K | LED40.K 301.56,20.01 307.66,26.1 332.04,26.1 R80.1 | v340.81,106.11 332.81,106.11 IC11.8 | 242.89,79.06 244.8,80.97 R34.1 | 242.89,79.06 241.75,77.92 230.7,77.92 229.17,76.39 IC6.8 | 242.89,79.06 268.8,79.06 268.8,76.39 IC16.8 | 179.26,56.58 165.17,42.48 165.17,41.34 R32.1 | 179.26,56.58 181.17,58.49 181.17,59.63 LED45.K | 179.26,56.58 192.6,43.25 202.88,43.25 204.41,41.72 | 204.41,41.72 204.79,41.34 R37.1 204.41,41.72 | R38.1 244.8,40.96 223.84,20.01 221.55,20.01 LED38.K | 204.41,41.72 221.17,58.49 221.17,59.63 LED46.K | LED29.K 21.53,60.01 39.44,77.92 41.72,77.92 44.77,80.97 R25.1 | 86.3,79.82 85.16,80.97 R26.1 | 86.3,79.82 87.06,79.06 107.25,79.06 108.4,77.92 108.78,77.92 108.78,76.39 IC15.8 | 86.3,79.82 82.49,76.01 69.15,76.01 IC4.8 | 169.74,16.96 170.5,17.72 179.64,17.72 181.55,19.62 LED37.K | 169.74,16.96 168.98,16.2 IC5.8 | 169.74,16.96 167.07,19.62 141.54,19.62 LED36.K | 96.97,54.3 85.16,42.48 85.16,41.34 R30.1 84.78,40.96 81.73,37.91 61.15,37.91 | 96.97,54.3 101.16,58.49 101.16,59.63 LED31.K | LED33.K 21.53,20.01 39.44,37.91 41.72,37.91 44.77,40.96 R29.1 45.15,40.96 60.39,40.96 | 61.15,37.91 61.15,40.96 60.39,40.96 | 61.15,37.91 61.15,20.01 LED34.K | 96.97,54.3 111.83,54.3 124.78,41.34 R31.1 | 60.39,40.96 60.39,57.72 61.15,58.49 61.15,59.63 LED30.K
N$1
  Bottom 0.356: IC2.14 55.82,243.65 55.82,240.99 48.58,240.99 45.53,237.94 36.01,237.94 16.2,257.75 16.2,317.95 48.96,317.95 52.01,321 67.25,321 68.77,322.52 68.77,323.66 IC1.9
N$2
  Bottom 0.356: IC2.15 53.53,244.03 53.53,248.22 28.01,248.22 18.86,257.37 18.86,259.65 LED9.A
N$3
  Bottom 0.356: IC1.15 53.53,324.04 53.53,326.71 29.53,326.71 18.86,337.38 18.86,339.66 LED1.A
N$4
  Bottom 0.356: IC1.1 50.87,316.04 37.15,302.33 20.39,302.33 18.86,300.8 18.86,300.04 LED5.A
N$5
  Top 0.356: IC1.2 53.91,316.04 53.91,304.61 58.49,300.04 LED6.A
N$6  (via drill 0.61)
  Top 0.356: v48.96,330.52 48.96,321 52.77,321 55.82,317.95 55.82,316.42 IC1.3
  Bottom 0.356: v48.96,330.52 58.11,339.66 58.49,339.66 LED2.A
N$7  (via drill 0.61)
  Top 0.356: v58.87,307.28 58.87,316.04 IC1.4
  Bottom 0.356: v58.87,307.28 66.11,300.04 98.49,300.04 LED7.A
N$8  (via drill 0.61)
  Top 0.356: v66.87,306.14 61.53,311.47 61.53,316.04 IC1.5
  Bottom 0.356: v66.87,306.14 70.68,302.33 136.21,302.33 138.5,300.04 LED8.A
N$9  (via drill 0.61)
  Top 0.356: v66.87,309.18 64.2,311.85 64.2,315.66 63.82,316.04 IC1.6 | v128.21,316.04 138.5,326.33 138.5,339.66 LED4.A
  Bottom 0.356: v66.87,309.18 121.35,309.18 v128.21,316.04
N$10  (via drill 0.61)
  Top 0.356: v77.92,325.19 89.35,336.62 v89.35,343.86
  Bottom 0.356: v77.92,325.19 71.82,319.09 66.49,319.09 66.49,316.42 IC1.7 | v89.35,343.86 94.68,343.86 98.49,340.05 LED3.A
N$11
  Top 0.356: IC2.2 53.91,236.03 53.91,224.6 58.49,220.03 LED14.A
N$12
  Top 0.356: IC2.3 55.82,236.41 55.82,237.94 52.77,240.99 48.96,240.99 48.96,250.13 58.49,259.65 LED10.A
N$13  (via drill 0.61)
  Top 0.356: v95.06,228.41 98.49,224.98 98.49,220.03 LED15.A
  Bottom 0.356: v95.06,228.41 58.87,228.41 58.87,236.03 IC2.4
N$14  (via drill 0.61)
  Top 0.356: v61.53,223.84 61.53,236.03 IC2.5
  Bottom 0.356: v61.53,223.84 63.06,222.32 136.21,222.32 138.5,220.03 LED16.A
N$15
  Bottom 0.356: IC2.6 63.82,236.03 63.82,231.46 123.26,231.46 138.5,246.7 138.5,259.65 LED12.A
N$16
  Bottom 0.356: IC2.7 66.49,236.41 66.49,240.99 76.01,240.99 94.68,259.65 98.49,259.65 LED11.A
N$17  (via drill 0.61)
  Top 0.356: v53.53,168.59 53.53,164.02 IC3.15
  Bottom 0.356: v53.53,168.59 50.1,172.02 24.2,172.02 18.86,177.36 18.86,179.64 LED17.A
N$18
  Bottom 0.356: IC3.2 53.91,156.02 53.91,140.02 58.49,140.02 LED22.A
N$19
  Top 0.356: IC3.3 55.82,156.4 55.82,157.93 52.77,160.97 48.2,160.97 48.2,169.74 58.49,180.03 LED18.A
N$20
  Bottom 0.356: IC3.4 58.87,156.02 58.87,143.07 95.44,143.07 98.49,140.02 LED23.A
N$21
  Bottom 0.356: IC3.5 61.53,156.02 61.53,144.97 133.54,144.97 138.5,140.02 LED24.A
N$22  (via drill 0.61)
  Top 0.356: v121.35,151.45 138.5,168.59 138.5,179.64 LED20.A
  Bottom 0.356: v121.35,151.45 63.82,151.45 63.82,156.02 IC3.6
N$23  (via drill 0.61)
  Top 0.356: v80.58,153.35 82.49,155.26 82.49,177.36 84.78,179.64 98.49,179.64 LED19.A
  Bottom 0.356: v80.58,153.35 66.49,153.35 66.49,156.02 IC3.7
N$24
  Bottom 0.356: IC4.15 53.53,84.01 53.53,90.11 26.1,90.11 18.86,97.35 18.86,99.63 LED25.A
N$25
  Bottom 0.356: IC4.2 53.91,76.01 53.91,60.01 58.49,60.01 LED30.A
N$26
  Top 0.356: IC4.3 55.82,76.39 55.82,77.92 52.77,80.97 48.96,80.97 48.96,90.11 58.49,99.63 LED26.A
N$27
  Bottom 0.356: IC4.4 58.87,76.01 58.87,62.3 96.2,62.3 98.49,60.01 LED31.A
N$28  (via drill 0.61)
  Top 0.356: v69.15,210.89 69.15,179.26 56.58,166.69 56.58,164.4 56.2,164.02 IC3.14 | v72.96,214.7 72.96,239.84 69.15,243.65 IC2.9
  Bottom 0.356: v72.96,214.7 v69.15,210.89
N$29
  Bottom 0.356: IC4.5 61.53,76.01 61.53,68.77 129.73,68.77 138.5,60.01 LED32.A
N$30  (via drill 0.61)
  Top 0.356: v123.64,71.44 138.5,86.3 138.5,99.63 LED28.A
  Bottom 0.356: v123.64,71.44 63.82,71.44 63.82,76.01 IC4.6
N$31  (via drill 0.61)
  Top 0.356: v71.82,98.11 71.82,82.87 66.49,77.54 66.49,76.39 IC4.7
  Bottom 0.356: v71.82,98.11 73.34,99.63 98.49,99.63 LED27.A
N$32
  Top 0.356: IC5.15 153.35,23.43 153.35,22.29 148.78,17.72 63.44,17.72 63.44,21.15 62.3,22.29 18.86,22.29 18.86,20.01 LED33.A
N$33  (via drill 0.61)
  Top 0.356: v153.74,9.34 153.74,15.81 IC5.2
  Bottom 0.356: v153.74,9.34 208.22,9.34 218.51,19.62 LED38.A
N$34
  Top 0.356: IC5.3 156.02,15.81 156.02,8.57 154.88,7.43 58.87,7.43 58.87,19.62 LED34.A
N$35
  Top 0.356: IC5.4 159.07,16.2 159.07,17.72 160.59,19.24 176.6,19.24 176.6,18.86 177.74,17.72 258.51,17.72 258.51,19.62 LED39.A
N$36
  Top 0.356: IC5.5 161.36,15.81 161.74,15.43 161.74,14.67 163.26,13.15 298.52,13.15 298.52,19.62 LED40.A
N$37
  Bottom 0.356: IC5.6 163.64,15.81 163.64,13.15 144.97,13.15 138.5,19.62 LED36.A
N$38
  Top 0.356: IC4.14 56.2,84.01 56.58,84.39 56.58,86.68 71.06,101.16 71.06,161.74 69.15,163.64 IC3.9
N$39
  Bottom 0.356: IC5.7 166.31,15.81 166.31,11.24 106.87,11.24 98.49,19.62 LED35.A
N$40  (via drill 0.61)
  Top 0.356: v189.55,86.68 178.88,97.35 178.88,99.63 LED41.A
  Bottom 0.356: v189.55,86.68 213.55,86.68 213.55,84.01 IC6.15
N$41
  Top 0.356: IC6.2 213.93,76.01 213.93,73.34 217.74,69.53 217.74,60.77 218.51,60.01 LED46.A
N$42
  Top 0.356: IC6.3 215.84,76.39 215.84,77.92 212.79,80.97 208.98,80.97 208.98,91.63 216.98,99.63 218.51,99.63 LED42.A
N$43  (via drill 0.61)
  Top 0.356: v226.89,61.92 219.65,69.15 219.65,71.44 218.89,72.2 218.89,76.01 IC6.4
  Bottom 0.356: v226.89,61.92 228.79,60.01 258.51,60.01 LED47.A
N$44  (via drill 0.61)
  Top 0.356: v221.55,71.06 221.55,76.01 IC6.5
  Bottom 0.356: v221.55,71.06 224.22,68.39 290.13,68.39 298.52,60.01 LED48.A
N$45  (via drill 0.61)
  Top 0.356: v226.89,71.06 224.22,73.73 224.22,75.63 223.84,76.01 IC6.6 | v297.37,71.06 298.52,72.2 298.52,99.63 LED44.A
  Bottom 0.356: v297.37,71.06 v226.89,71.06
N$46  (via drill 0.61)
  Top 0.356: v257.75,87.06 258.51,87.82 258.51,99.63 LED43.A
  Bottom 0.356: v257.75,87.06 242.13,87.06 236.03,80.97 226.51,80.97 226.51,76.39 IC6.7
N$47  (via drill 0.61)
  Top 0.356: v213.17,168.59 213.17,164.4 213.55,164.02 IC7.15
  Bottom 0.356: v213.17,168.59 207.84,173.93 182.31,173.93 178.88,177.36 178.88,179.64 LED49.A
N$48  (via drill 0.61)
  Top 0.356: v81.35,77.92 82.49,76.77 82.49,55.44 v111.06,26.86
  Bottom 0.356: v81.35,77.92 74.87,77.92 69.15,83.63 IC4.9 | v111.06,26.86 154.5,26.86 156.02,25.34 156.02,23.81 IC5.14
N$49
  Top 0.356: IC7.2 213.93,156.02 213.93,144.59 218.51,140.02 LED54.A
N$50
  Top 0.356: IC7.3 215.84,156.4 215.84,157.93 212.79,160.97 208.98,160.97 208.98,170.12 218.51,179.64 LED50.A
N$51  (via drill 0.61)
  Top 0.356: v218.89,148.78 218.89,156.02 IC7.4
  Bottom 0.356: v218.89,148.78 227.65,140.02 258.51,140.02 LED55.A
N$52  (via drill 0.61)
  Top 0.356: v221.55,151.45 221.55,156.02 IC7.5
  Bottom 0.356: v221.55,151.45 287.09,151.45 298.52,140.02 LED56.A
N$53  (via drill 0.61)
  Top 0.356: v224.22,149.54 224.22,155.64 223.84,156.02 IC7.6 | v287.85,147.64 298.52,158.31 298.52,179.64 LED52.A
  Bottom 0.356: v224.22,149.54 226.13,147.64 v287.85,147.64
N$54  (via drill 0.61)
  Top 0.356: v229.94,149.54 226.51,152.97 226.51,156.02 IC7.7 | v240.6,149.54 242.51,151.45 v242.51,178.12
  Bottom 0.356: v240.6,149.54 v229.94,149.54 | v242.51,178.12 244.03,179.64 258.51,179.64 LED51.A
N$55  (via drill 0.61)
  Top 0.356: v213.17,250.51 213.17,244.41 213.55,244.03 IC8.15
  Bottom 0.356: v213.17,250.51 209.74,253.94 182.31,253.94 178.88,257.37 178.88,259.65 LED57.A
N$56
  Top 0.356: IC8.2 213.93,236.03 213.93,224.6 218.51,220.03 LED62.A
N$57
  Top 0.356: IC8.3 215.84,236.41 215.84,237.94 212.79,240.99 208.98,240.99 208.98,250.13 218.51,259.65 LED58.A
N$58  (via drill 0.61)
  Top 0.356: v196.79,90.49 196.79,51.63 168.98,23.81 IC5.9 | v210.89,90.49 215.84,85.54 215.84,84.01 IC6.14
  Bottom 0.356: v210.89,90.49 v196.79,90.49
N$59  (via drill 0.61)
  Top 0.356: v218.89,228.03 218.89,236.03 IC8.4
  Bottom 0.356: v218.89,228.03 225.36,221.55 256.99,221.55 258.51,220.03 LED63.A
N$60  (via drill 0.61)
  Top 0.356: v220.03,240.99 220.79,240.22 220.79,236.79 221.17,236.41 IC8.5 | v285.56,246.7 293.94,238.32 v293.94,224.6
  Bottom 0.356: v220.03,240.99 236.03,240.99 241.75,246.7 v285.56,246.7 | v293.94,224.6 298.52,220.03 LED64.A
N$61  (via drill 0.61)
  Top 0.356: v295.85,227.27 298.52,229.94 298.52,259.65 LED60.A
  Bottom 0.356: v295.85,227.27 252.8,227.27 251.65,228.41 223.84,228.41 223.84,236.03 IC8.6
N$62  (via drill 0.61)
  Top 0.356: v240.6,233.37 242.51,235.27 242.51,257.37 244.8,259.65 258.51,259.65 LED59.A
  Bottom 0.356: v240.6,233.37 226.51,233.37 226.51,236.03 IC8.7
N$63  (via drill 0.61)
  Top 0.356: v213.17,330.52 213.17,324.42 213.55,324.04 IC9.15
  Bottom 0.356: v213.17,330.52 211.65,332.04 184.22,332.04 178.88,337.38 178.88,339.66 LED65.A
N$64
  Bottom 0.356: IC9.2 213.93,316.04 213.93,300.04 218.51,300.04 LED70.A
N$65
  Top 0.356: IC9.3 215.84,316.42 215.84,317.95 212.79,321 208.22,321 208.22,331.66 216.22,339.66 218.51,339.66 LED66.A
N$66
  Bottom 0.356: IC9.4 218.89,316.04 218.89,302.33 256.23,302.33 258.51,300.04 LED71.A
N$67
  Bottom 0.356: IC9.5 221.55,316.04 221.55,304.99 293.56,304.99 298.52,300.04 LED72.A
N$68
  Top 0.356: IC6.9 229.17,84.01 229.94,84.78 229.94,103.83 225.75,108.02 225.75,142.31 231.84,148.4 231.84,165.55 228.41,168.98 228.41,169.74 227.65,170.5 216.22,170.5 216.22,164.02 IC7.14
N$69
  Top 0.356: IC9.6 223.84,316.42 224.22,316.8 224.22,317.95 227.27,321 231.84,321 231.84,329 245.18,342.33 298.52,342.33 298.52,340.05 LED68.A
N$70
  Top 0.356: IC9.7 226.51,316.42 226.51,317.57 228.03,319.09 233.75,319.09 233.75,328.62 244.8,339.66 258.51,339.66 LED67.A
N$71
  Top 0.356: IC10.15 333.57,204.03 333.19,204.41 333.19,221.94 329.76,225.36 329.76,330.9 338.52,339.66 LED73.A
N$72  (via drill 0.61)
  Top 0.356: v333.95,142.31 333.95,196.03 IC10.2
  Bottom 0.356: v333.95,142.31 336.24,140.02 338.52,140.02 LED78.A
N$73  (via drill 0.61)
  Top 0.356: v323.28,198.69 322.52,199.46 v322.52,283.66
  Bottom 0.356: v323.28,198.69 326.33,198.69 326.71,199.07 335.85,199.07 335.85,196.41 IC10.3 | v322.52,283.66 338.52,299.66 LED74.A
N$74
  Top 0.356: IC10.4 338.52,196.03 338.52,183.07 336.24,180.79 336.24,133.54 338.9,130.88 338.9,100.02 LED79.A
N$75  (via drill 0.61)
  Top 0.356: v342.71,147.26 342.71,176.98 343.47,177.74 343.47,181.17 341.57,183.07 341.57,196.03 IC10.5 | v314.9,144.21 293.56,122.88 v293.56,98.11 | v334.33,89.35 334.33,82.87 338.52,78.68 338.52,60.01 LED80.A
  Bottom 0.356: v342.71,147.26 339.66,144.21 v314.9,144.21 | v293.56,98.11 302.33,89.35 v334.33,89.35
N$76  (via drill 0.61)
  Top 0.356: v329,215.46 v329,200.98
  Bottom 0.356: v329,200.98 343.47,200.98 343.47,196.41 IC10.6 | v329,215.46 333.19,219.65 338.52,219.65 LED76.A
N$77  (via drill 0.61)
  Top 0.356: v351.09,215.84 351.09,202.12 346.52,197.55 346.52,196.41 IC10.7 | v338.9,228.03 338.9,259.65 LED75.A
  Bottom 0.356: v338.9,228.03 v351.09,215.84
N$78  (via drill 0.61)
  Top 0.356: v247.08,168.21 247.46,168.59 247.46,209.74 240.6,216.6 v240.6,223.46
  Bottom 0.356: v247.08,168.21 246.32,168.21 242.89,164.78 229.94,164.78 229.17,164.02 IC7.9 | v240.6,223.46 237.56,226.51 223.46,226.51 216.6,233.37 202.88,233.37 196.79,239.46 196.79,246.7 214.7,246.7 215.84,245.56 215.84,244.03 IC8.14
N$79
  Bottom 0.356: IC12.1 90.87,316.04 85.92,311.09 59.63,311.09 45.15,296.61 R5.2 44.77,296.61 23.43,296.61 S5.1
N$80  (via drill 0.61)
  Top 0.356: v228.41,261.18 228.41,244.41 228.79,244.03 IC8.9
  Bottom 0.356: v228.41,261.18 195.26,294.32 181.17,294.32 176.22,299.28 176.22,317.95 206.69,317.95 209.74,321 214.7,321 215.84,322.14 215.84,323.66 IC9.14
N$81  (via drill 0.61)
  Top 0.356: v122.11,233.37 138.5,216.98 143.07,216.98 S16.1
  Bottom 0.356: v122.11,233.37 103.83,233.37 103.83,236.03 IC13.6 | R16.2 164.78,216.6 143.45,216.6 S16.1
N$82
  Top 0.356: IC13.13 98.87,244.03 98.87,252.42 103.06,256.61 S11.1
  Bottom 0.356: R11.2 124.78,256.61 103.44,256.61 S11.1
N$83
  Bottom 0.356: IC13.7 106.49,236.41 106.49,239.08 116.02,239.08 116.78,239.84 116.78,253.94 129.35,253.94 137.73,262.32 142.31,262.32 143.45,261.18 143.45,256.99 S12.1 143.45,256.61 164.78,256.61 R12.2
N$84
  Top 0.356: IC13.4 98.49,236.03 98.49,234.89 85.16,221.55 85.16,216.6 R14.2
  Bottom 0.356: S14.1 63.44,216.6 84.78,216.6 R14.2
N$85
  Top 0.356: IC13.5 101.54,236.03 101.54,223.08 103.44,221.17 103.44,216.98 S15.1
  Bottom 0.356: R15.2 124.78,216.6 103.44,216.6 S15.1
N$86
  Top 0.356: IC13.14 95.82,244.03 95.82,245.56 85.16,256.23 R10.2
  Bottom 0.356: S10.1 63.44,256.61 84.78,256.61 R10.2
N$87  (via drill 0.61)
  Top 0.356: v81.35,249.37 89.35,249.37 93.54,245.18 93.54,244.03 IC13.15
  Bottom 0.356: v81.35,249.37 76.39,254.32 47.06,254.32 45.15,256.23 R9.2 44.77,256.61 23.43,256.61 S9.1
N$88  (via drill 0.61)
  Top 0.356: v81.35,226.51 90.87,236.03 IC13.1
  Bottom 0.356: v81.35,226.51 80.58,225.75 54.3,225.75 45.15,216.6 R13.2 44.77,216.6 23.43,216.6 S13.1
N$89
  Top 0.356: IC10.14 335.85,204.03 335.85,331.28 343.47,338.9 343.47,341.19 340.43,344.24 229.17,344.24 229.17,324.04 IC9.9
N$90  (via drill 0.61)
  Top 0.356: v76.01,343.86 76.01,323.28 80.2,323.28 82.11,321.38 82.11,313.38 94.68,313.38 95.82,314.52 95.82,316.04 IC12.3
  Bottom 0.356: v76.01,343.86 79.06,346.9 85.92,346.9 87.44,348.43 87.44,349.95 JP1.10
N$91  (via drill 0.61)
  Top 0.356: v122.11,313.38 138.5,296.99 143.07,296.99 S8.1
  Bottom 0.356: v122.11,313.38 103.83,313.38 103.83,316.04 IC12.6 | R8.2 164.78,296.61 143.45,296.61 S8.1
N$92
  Top 0.356: IC14.6 103.44,156.02 103.44,136.97 S24.1
  Bottom 0.356: R24.2 124.78,136.59 103.44,136.59 S24.1
N$93
  Top 0.356: IC12.4 98.49,316.04 98.49,309.95 85.16,296.61 R6.2
  Bottom 0.356: S6.1 63.44,296.61 84.78,296.61 R6.2
N$94
  Top 0.356: IC12.13 98.87,324.04 98.87,332.43 103.06,336.62 S3.1
  Bottom 0.356: R3.2 124.78,336.62 103.44,336.62 S3.1
N$95  (via drill 0.61)
  Top 0.356: v133.16,317.95 143.07,327.85 143.07,336.62 S4.1 143.45,336.62 164.78,336.62 R4.2
  Bottom 0.356: v133.16,317.95 113.35,317.95 112.21,319.09 106.49,319.09 106.49,316.42 IC12.7
N$96
  Top 0.356: IC12.5 101.54,316.04 101.54,303.09 103.44,301.18 103.44,296.99 S7.1
  Bottom 0.356: R7.2 124.78,296.61 103.44,296.61 S7.1
N$97  (via drill 0.61)
  Top 0.356: v304.99,111.06 295.47,101.54 295.47,50.48 v325.95,20.01
  Bottom 0.356: v304.99,111.06 317.19,111.06 317.19,113.73 IC11.15 | v325.95,20.01 338.52,20.01 LED81.A
N$98  (via drill 0.61)
  Top 0.356: v316.8,180.79 316.8,119.45 319.47,116.78 319.47,114.49 319.85,114.11 IC11.14
  Bottom 0.356: v316.8,180.79 323.28,187.26 343.86,187.26 351.09,194.5 351.09,203.65 349.19,203.65 IC10.9
N$99  (via drill 0.61)
  Top 0.356: v95.82,330.52 95.82,324.04 IC12.14
  Bottom 0.356: v95.82,330.52 90.11,336.24 85.16,336.24 R2.2 84.78,336.62 63.44,336.62 S2.1
N$100  (via drill 0.61)
  Top 0.356: v93.54,341.19 93.54,324.04 IC12.15 | S1.1 23.43,336.62 44.77,336.62 R1.2
  Bottom 0.356: v93.54,341.19 92.78,341.95 62.68,341.95 62.3,342.33 50.87,342.33 45.15,336.62 R1.2
N$101
  Bottom 0.356: IC14.13 98.87,164.02 98.87,176.6 103.06,176.6 S19.1 103.44,176.6 124.78,176.6 R19.2
N$102
  Bottom 0.356: IC14.7 106.49,156.4 106.49,160.97 116.02,160.97 131.64,176.6 143.07,176.6 S20.1 143.45,176.6 163.64,176.6 164.78,175.45 R20.2
N$103  (via drill 0.61)
  Top 0.356: v92.01,141.16 98.49,147.64 98.49,156.02 IC14.4
  Bottom 0.356: v92.01,141.16 87.44,136.59 85.16,136.59 R22.2 84.78,136.59 63.44,136.59 S22.1
N$104
  Bottom 0.356: IC14.5 101.54,156.02 101.54,153.35 131.26,153.35 143.45,141.16 143.45,136.97 S23.1 143.45,136.59 164.78,136.59 R23.2
N$105
  Top 0.356: IC14.14 95.82,164.02 95.82,165.93 85.16,176.6 R18.2
  Bottom 0.356: S18.1 63.44,176.6 84.78,176.6 R18.2
N$106  (via drill 0.61)
  Top 0.356: v85.16,173.55 93.54,165.17 93.54,164.02 IC14.15
  Bottom 0.356: v85.16,173.55 84.78,173.93 47.44,173.93 45.15,176.22 R17.2 44.77,176.6 23.43,176.6 S17.1
N$107  (via drill 0.61)
  Top 0.356: v90.11,136.21 90.11,155.26 90.87,156.02 IC14.1
  Bottom 0.356: v90.11,136.21 87.82,133.92 47.44,133.92 45.15,136.21 R21.2 44.77,136.59 23.43,136.59 S21.1
N$108
  Bottom 0.356: IC15.6 103.83,76.01 103.83,73.34 131.26,73.34 143.45,61.15 143.45,56.96 S32.1 143.45,56.58 164.78,56.58 R32.2
N$109
  Bottom 0.356: IC15.13 98.87,84.01 98.87,96.59 103.06,96.59 S27.1 103.44,96.59 124.78,96.59 R27.2
N$110  (via drill 0.61)
  Top 0.356: v117.54,88.58 106.49,77.54 106.49,76.39 IC15.7
  Bottom 0.356: v117.54,88.58 122.88,93.92 140.4,93.92 143.07,96.59 S28.1 143.45,96.59 164.78,96.59 R28.2
N$111  (via drill 0.61)
  Top 0.356: v88.97,245.94 88.97,240.99 92.78,240.99 95.82,237.94 95.82,236.41 IC13.3 | v107.64,254.32 114.49,261.18 v114.49,319.85
  Bottom 0.356: v88.97,245.94 97.35,254.32 v107.64,254.32 | v114.49,319.85 113.35,321 105.35,321 103.83,322.52 103.83,323.66 IC12.11
N$112
  Top 0.356: IC15.4 98.49,76.01 98.49,69.92 85.16,56.58 R30.2
  Bottom 0.356: S30.1 63.44,56.58 84.78,56.58 R30.2
N$113
  Top 0.356: IC15.5 101.54,76.01 101.54,63.06 103.44,61.15 103.44,56.96 S31.1
  Bottom 0.356: R31.2 124.78,56.58 103.44,56.58 S31.1
N$114
  Bottom 0.356: IC15.14 95.82,84.01 95.82,96.2 85.16,96.2 R26.2 84.78,96.2 63.82,96.2 63.44,96.59 S26.1
N$115
  Bottom 0.356: IC15.15 93.54,84.01 93.54,93.92 47.44,93.92 45.15,96.2 R25.2 44.77,96.59 23.43,96.59 S25.1
N$116  (via drill 0.61)
  Top 0.356: v74.87,73.34 65.72,64.2 65.72,55.82 64.2,54.3 45.15,54.3 45.15,56.2 R29.2
  Bottom 0.356: v74.87,73.34 88.2,73.34 90.87,76.01 IC15.1 | S29.1 23.43,56.58 44.77,56.58 R29.2
N$117  (via drill 0.61)
  Top 0.356: v264.23,66.49 264.23,75.63 263.85,76.01 IC16.6
  Bottom 0.356: v264.23,66.49 271.85,58.87 296.61,58.87 298.52,56.96 303.09,56.96 S40.1 303.47,56.96 304.61,58.11 323.28,58.11 324.81,56.58 R40.2
N$118
  Top 0.356: IC16.13 258.89,84.01 258.89,85.16 263.08,89.35 263.08,96.59 S35.1
  Bottom 0.356: R35.2 284.8,96.59 263.46,96.59 S35.1
N$119  (via drill 0.61)
  Top 0.356: v302.33,73.34 303.09,74.11 303.09,96.59 S36.1
  Bottom 0.356: v302.33,73.34 266.51,73.34 266.51,76.01 IC16.7 | R36.2 324.81,96.59 303.47,96.59 S36.1
N$120
  Top 0.356: IC16.4 258.51,76.01 258.51,69.92 245.18,56.58 R38.2
  Bottom 0.356: S38.1 223.46,56.58 244.8,56.58 R38.2
N$121  (via drill 0.61)
  Top 0.356: v96.59,149.54 96.59,155.64 96.2,156.02 IC14.3 | v109.16,149.54 112.97,153.35 v112.97,243.65
  Bottom 0.356: v109.16,149.54 v96.59,149.54 | v112.97,243.65 109.92,246.7 105.35,246.7 103.83,245.18 103.83,244.03 IC13.11
N$122
  Top 0.356: IC16.5 261.56,76.01 261.56,63.06 263.46,61.15 263.46,56.96 S39.1
  Bottom 0.356: R39.2 284.8,56.58 263.46,56.58 S39.1
N$123
  Top 0.356: IC16.14 255.84,84.01 255.84,85.92 245.18,96.59 R34.2
  Bottom 0.356: S34.1 223.46,96.59 244.8,96.59 R34.2
N$124  (via drill 0.61)
  Top 0.356: v245.18,93.54 253.18,85.54 253.18,84.39 253.56,84.01 IC16.15
  Bottom 0.356: v245.18,93.54 244.8,93.92 207.46,93.92 205.17,96.2 R33.2 204.79,96.59 183.45,96.59 S33.1
N$125  (via drill 0.61)
  Top 0.356: v212.03,72.96 205.17,66.11 205.17,56.58 R37.2
  Bottom 0.356: v212.03,72.96 247.84,72.96 250.89,76.01 IC16.1 | S37.1 183.45,56.58 204.79,56.58 R37.2
N$126  (via drill 0.61)
  Top 0.356: v264.23,145.74 264.23,155.64 263.85,156.02 IC17.6
  Bottom 0.356: v264.23,145.74 271.08,138.88 296.61,138.88 298.52,136.97 303.09,136.97 S48.1 303.47,136.59 324.81,136.59 R48.2
N$127
  Top 0.356: IC17.13 258.89,164.02 258.89,172.41 263.08,176.6 S43.1
  Bottom 0.356: R43.2 284.8,176.6 263.46,176.6 S43.1
N$128  (via drill 0.61)
  Top 0.356: v302.33,160.97 303.09,161.74 303.09,176.6 S44.1
  Bottom 0.356: v302.33,160.97 295.09,160.97 287.47,153.35 266.51,153.35 266.51,156.02 IC17.7 | R44.2 324.81,176.6 303.47,176.6 S44.1
N$129
  Top 0.356: IC17.4 258.51,156.02 258.51,149.93 245.18,136.59 R46.2
  Bottom 0.356: S46.1 223.46,136.59 244.8,136.59 R46.2
N$130
  Top 0.356: IC17.5 261.56,156.02 261.56,143.07 263.46,141.16 263.46,136.97 S47.1
  Bottom 0.356: R47.2 284.8,136.59 263.46,136.59 S47.1
N$131
  Top 0.356: IC15.3 95.82,76.39 95.82,77.92 92.78,80.97 88.2,80.97 88.2,157.16 92.01,160.97 103.44,160.97 103.44,163.64 IC14.11
N$132
  Top 0.356: IC17.14 255.84,163.64 255.84,162.12 254.7,160.97 247.46,160.97 247.46,164.78 245.18,167.07 245.18,176.22 R42.2
  Bottom 0.356: S42.1 223.46,176.6 223.84,176.22 244.8,176.22 R42.2
N$133  (via drill 0.61)
  Top 0.356: v253.18,174.31 253.18,164.4 253.56,164.02 IC17.15
  Bottom 0.356: v253.18,174.31 252.8,173.93 210.12,173.93 207.84,176.22 205.17,176.22 R41.2 204.79,176.6 183.45,176.6 S41.1
N$134
  Bottom 0.356: IC17.1 250.89,156.02 248.22,153.35 220.41,153.35 205.17,138.12 205.17,136.59 R45.2 204.79,136.59 183.45,136.59 S45.1
N$135  (via drill 0.61)
  Top 0.356: v254.32,229.17 245.18,220.03 245.18,216.6 R56.2 | v267.27,225.36 263.85,228.79 263.85,236.03 IC18.6
  Bottom 0.356: v254.32,229.17 263.46,229.17 263.46,236.03 IC18.6 | v267.27,225.36 279.47,225.36 287.09,217.74 302.33,217.74 303.09,216.98 S56.1
N$136
  Top 0.356: IC18.13 258.89,244.03 258.89,252.42 263.08,256.61 S51.1
  Bottom 0.356: R51.2 284.8,256.61 263.46,256.61 S51.1
N$137
  Bottom 0.356: IC18.7 266.51,236.41 266.51,240.99 276.04,240.99 279.85,244.8 291.28,244.8 303.09,256.61 S52.1 303.47,256.61 324.81,256.61 R52.2
N$138  (via drill 0.61)
  Top 0.356: v258.89,225.36 258.89,236.03 IC18.4
  Bottom 0.356: v258.89,225.36 261.94,222.32 272.23,222.32 | 272.23,222.32 279.08,222.32 284.8,216.6 R54.2 | 272.23,222.32 264.23,214.31 261.18,214.31 255.84,219.65 226.13,219.65 223.46,216.98 S54.1
N$139  (via drill 0.61)
  Top 0.356: IC18.5 261.56,236.03 261.56,223.08 263.46,221.17 263.46,216.98 S55.1 263.46,216.6 263.46,211.65 v267.27,207.84 | v324.42,207.84 324.42,215.84 324.81,216.22 R55.2
  Bottom 0.356: v267.27,207.84 v324.42,207.84
N$140
  Top 0.356: IC18.14 255.84,244.03 255.84,245.94 245.18,256.61 R50.2
  Bottom 0.356: S50.1 223.46,256.61 244.8,256.61 R50.2
N$141  (via drill 0.61)
  Top 0.356: v247.84,66.49 255.84,74.49 255.84,76.01 IC16.3
  Bottom 0.356: v247.84,66.49 140.4,66.49 128.97,77.92 111.06,77.92 108.02,80.97 105.35,80.97 103.83,82.49 103.83,83.63 IC15.11
N$142  (via drill 0.61)
  Top 0.356: v245.18,253.56 253.18,245.56 253.18,244.41 253.56,244.03 IC18.15
  Bottom 0.356: v245.18,253.56 244.8,253.94 212.03,253.94 209.74,256.23 205.17,256.23 R49.2 204.79,256.61 183.45,256.61 S49.1
N$143  (via drill 0.61)
  Top 0.356: v242.51,217.74 242.51,227.65 250.89,236.03 IC18.1
  Bottom 0.356: v242.51,217.74 239.08,214.31 207.08,214.31 205.17,216.22 R53.2 204.79,216.6 183.45,216.6 S53.1
N$144  (via drill 0.61)
  Top 0.356: v295.85,313.38 303.47,305.75 303.47,296.99 S64.1
  Bottom 0.356: v295.85,313.38 263.85,313.38 263.85,316.04 IC19.6 | R64.2 324.81,296.61 303.47,296.61 S64.1
N$145
  Top 0.356: IC19.13 258.89,324.04 258.89,332.43 263.08,336.62 S59.1 263.46,336.62 284.8,336.62 R59.2
N$146
  Top 0.356: R60.2 324.81,336.62 303.47,336.62 S60.1
  Bottom 0.356: IC19.7 266.51,316.42 266.51,319.09 277.18,319.09 278.32,317.95 285.56,317.95 303.09,335.47 303.09,336.62 S60.1
N$147
  Top 0.356: IC19.4 258.89,316.04 258.89,309.95 245.18,296.23 R62.2
  Bottom 0.356: S62.1 223.46,296.61 244.8,296.61 R62.2
N$148
  Top 0.356: IC19.5 261.56,316.04 261.56,303.09 263.46,301.18 263.46,296.99 S63.1
  Bottom 0.356: R63.2 284.8,296.61 263.46,296.61 S63.1
N$149
  Top 0.356: IC19.14 255.84,324.04 255.84,325.57 245.18,336.24 R58.2
  Bottom 0.356: S58.1 223.46,336.62 244.8,336.62 R58.2
N$150
  Bottom 0.356: IC19.15 253.56,324.04 253.56,333.95 207.46,333.95 205.17,336.24 R57.2 204.79,336.62 183.45,336.62 S57.1
N$151
  Top 0.356: IC16.11 263.46,83.63 263.46,82.11 262.32,80.97 247.46,80.97 247.46,88.2 242.51,93.16 242.51,141.16 255.84,154.5 255.84,156.02 IC17.3
N$152
  Bottom 0.356: IC19.1 250.89,316.42 249.37,317.95 231.08,317.95 229.94,319.09 210.12,319.09 205.17,314.14 205.17,296.61 R61.2 204.79,296.61 183.45,296.61 S61.1
N$153  (via drill 0.61)
  Top 0.356: v277.56,186.12 273.75,189.93 273.75,322.52 269.56,326.71 263.85,326.71 263.85,324.04 IC19.11
  Bottom 0.356: v277.56,186.12 296.99,186.12 296.99,188.79 IC20.3
N$155  (via drill 0.61)
  Top 0.356: v288.61,199.84 282.51,193.74 282.51,87.06 293.56,76.01 v293.56,68.39
  Bottom 0.356: v288.61,199.84 304.61,199.84 304.61,196.79 IC20.11 | v293.56,68.39 294.71,67.25 315.66,67.25 316.8,66.11 316.8,64.58 IC21.3
N$161  (via drill 0.61)
  Top 0.356: v256.23,170.5 256.23,236.03 IC18.3
  Bottom 0.356: v256.23,170.5 260.04,166.69 262.32,166.69 263.46,165.55 263.46,164.02 IC17.11
N$171  (via drill 0.61)
  Top 0.356: v265.75,306.9 265.75,255.84 264.23,254.32 264.23,244.41 263.85,244.03 IC18.11
  Bottom 0.356: v265.75,306.9 259.27,313.38 257.75,313.38 256.23,314.9 256.23,316.04 IC19.3
PS  (via drill 0.61)